# EAGLE schematic NightLightWiring (EAGLE 7.6.0)
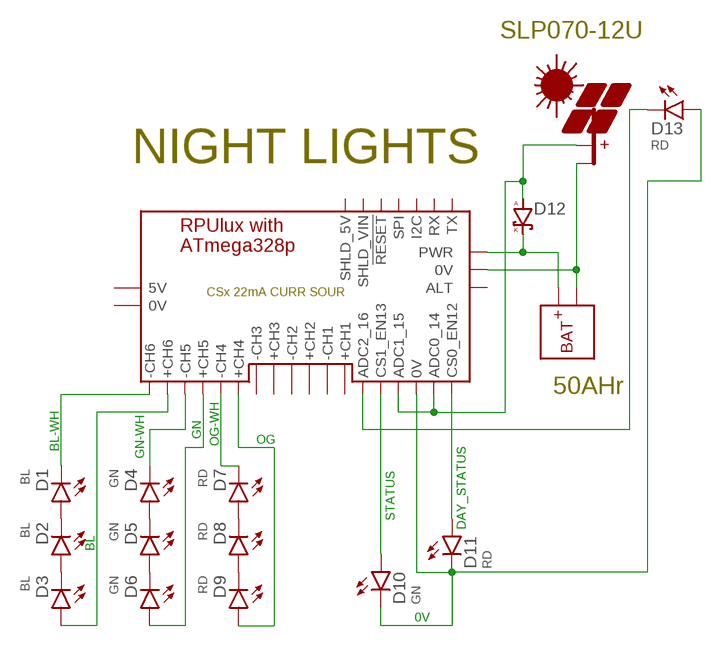
[diagram p0: schematic, sheet 1]

## Parts
D1  BL  LED5MM  [LED5MM]
D2  BL  LED5MM  [LED5MM]
D3  BL  LED5MM  [LED5MM]
D4  GN  LED5MM  [LED5MM]
D5  GN  LED5MM  [LED5MM]
D6  GN  LED5MM  [LED5MM]
D7  RD  LED5MM  [LED5MM]
D8  RD  LED5MM  [LED5MM]
D9  RD  LED5MM  [LED5MM]
D10  GN  LED5MM  [LED5MM]
D11  RD  LED5MM  [LED5MM]
D12  DSMB  [SMB]
D13  RD  LED5MM  [LED5MM]
PV2  PV  [NA-30]
U$1  RPULUX  [WITH_RPU_NAMES]
U$9  BAT  [NA-30]

## Nets
0V: D10.K D11.K D13.A U$1.0V@DIO2(0V)
12V: D12.K U$1.PWR U$9.1(+BAT)
BL: D3.A U$1.+CH6
BL-WH: D1.K U$1.-CH6
DAY_STATUS: D11.A U$1.22MA@ADC0(CS0_EN12)
GN: D6.A U$1.+CH5
GN-WH: D4.K U$1.-CH5
N$1: D4.A D5.K
N$2: D13.K U$1.ADC2(ADC2_16)
N$3: D5.A D6.K
N$4: D2.A D3.K
N$5: D7.A D8.K
N$6: D1.A D2.K
N$7: D8.A D9.K
N$19: D12.A PV2.1(+PV) U$1.ADC0(ADC0_14) U$1.ADC1(ADC1_15)
N$39: PV2.2(-PV) U$1.0V@PWR(0V) U$9.2(-BAT)
OG: D9.A U$1.+CH4
OG-WH: D7.K U$1.-CH4
STATUS: D10.A U$1.22MA@ADC1(CS1_EN13)
Unconnected: U$1.0V U$1.5V U$1.!RESET U$1.+CH1 U$1.+CH2 U$1.+CH3 U$1.-CH1 U$1.-CH2 U$1.-CH3 U$1.AUX(ALT) U$1.I2C U$1.RX U$1.SHLD_5V U$1.SHLD_VOUT(SHLD_VIN) U$1.SPI U$1.TX

## Notes on the sheet
- SLP070-12U
- NIGHT LIGHTS
- 50AHr

## Library data of the parts
D1-D11 D13 = D-LED:LED: LED 120120WH [CREE,XHGAWT-00-0000-00000HXE1] LED WHITE 6500K 150LUM-W120120
D12 = D-SBR:D: DIODE
PV2 = Documentation:PV
U$1 = Documentation:RPULUX
U$9 = Documentation:BAT